# Altium project PCB_Project.PrjPcb (part 1 of 11)
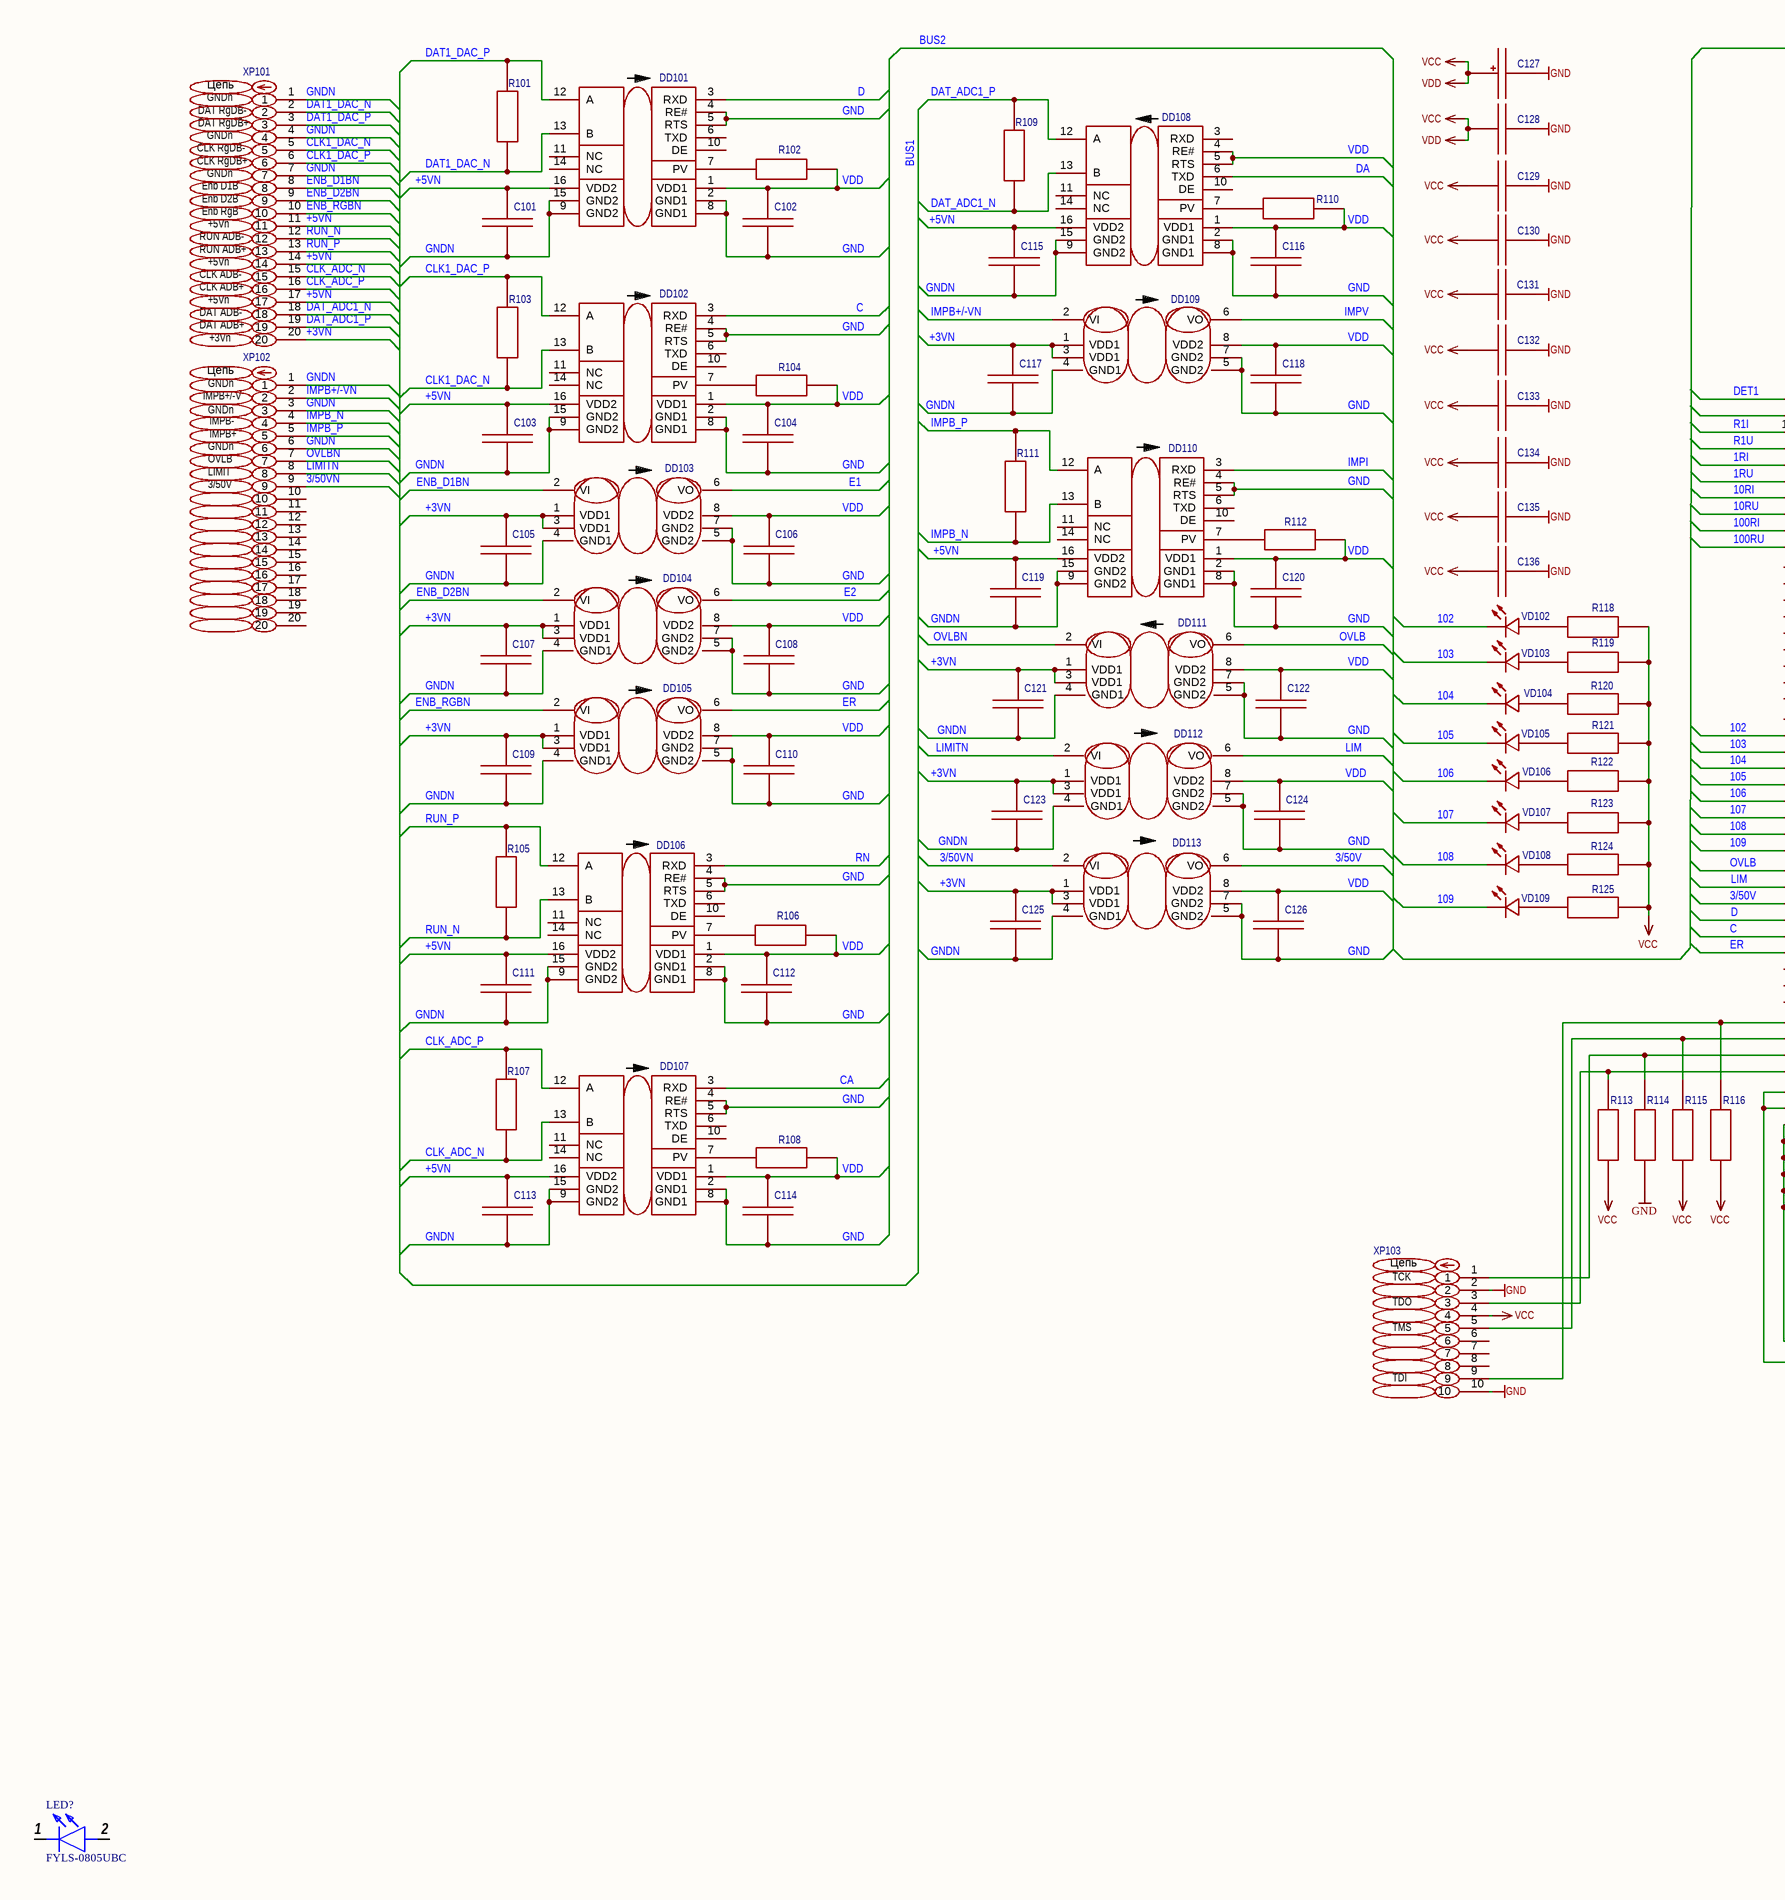
[diagram p0: УШЯИ.411618.029Э Э3 Лист 1.schdoc, left]
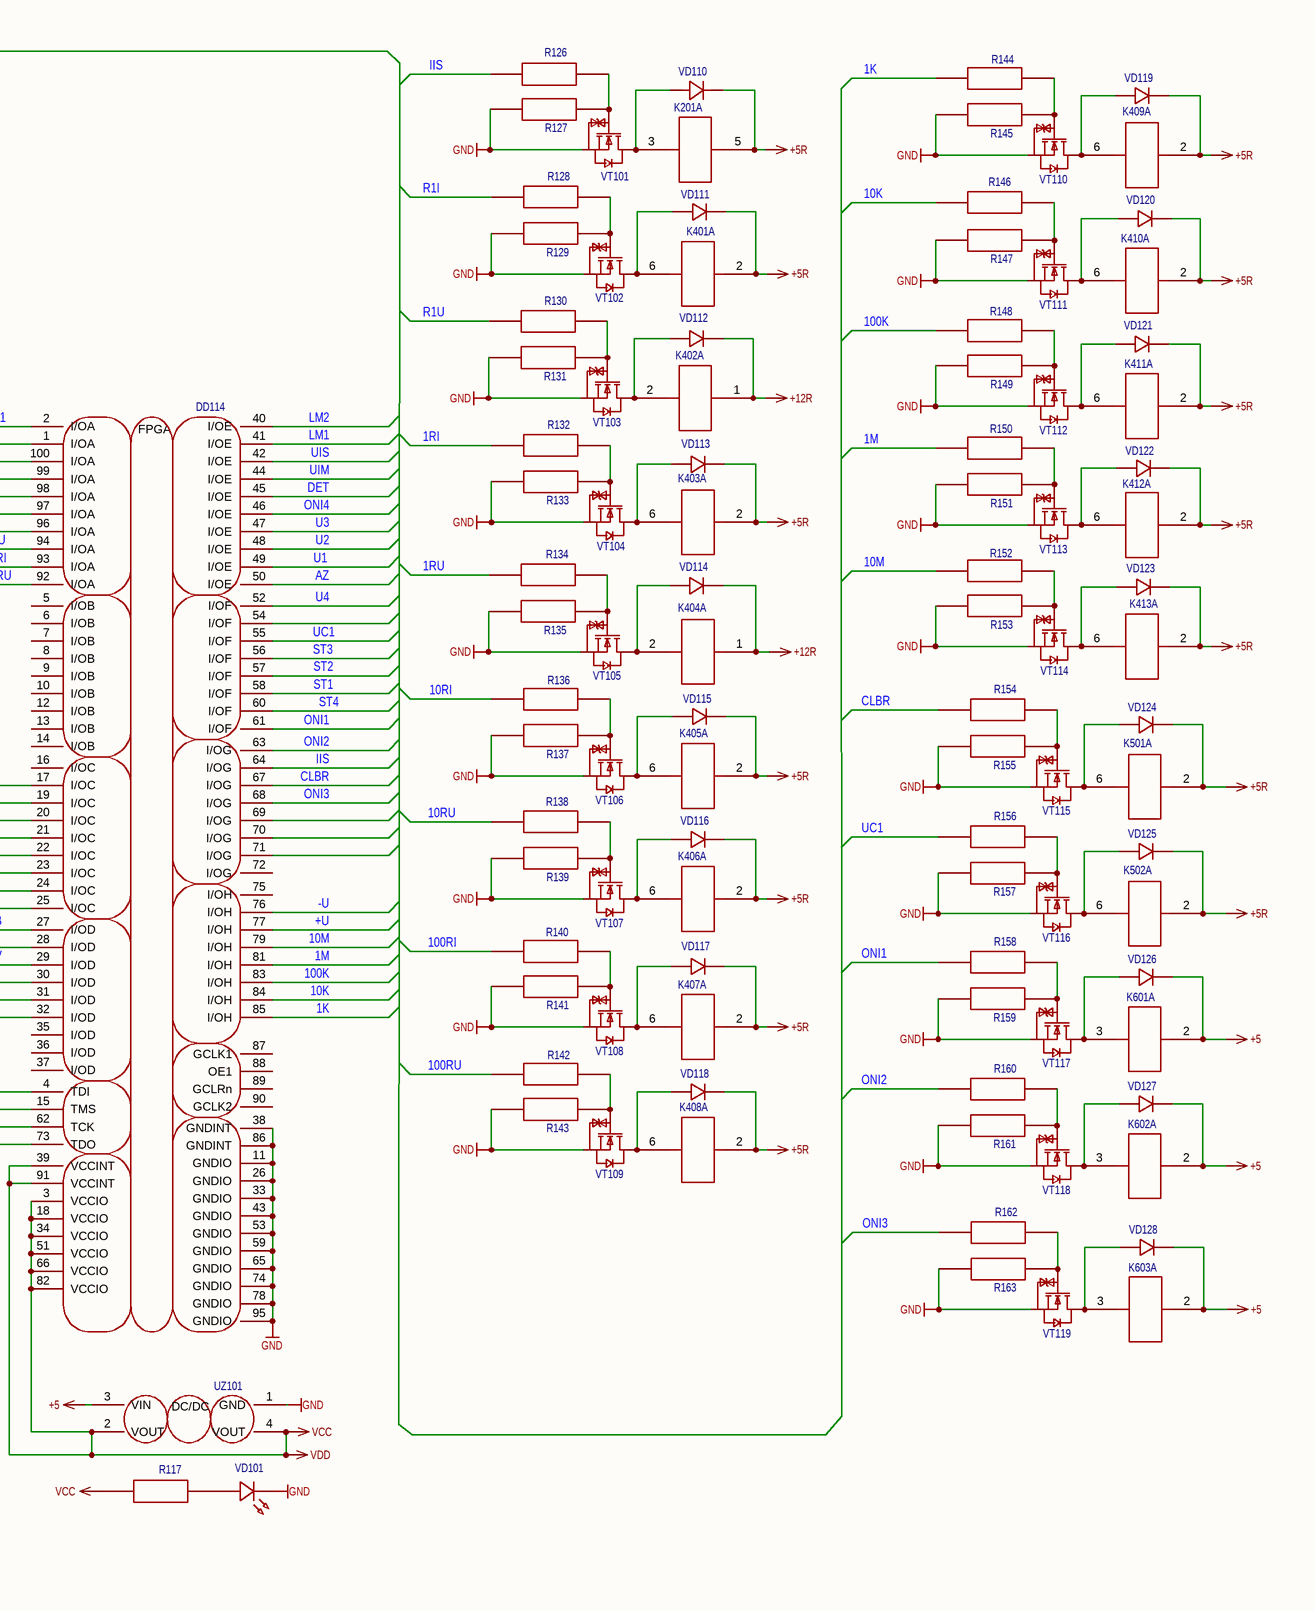
[diagram p1: УШЯИ.411618.029Э Э3 Лист 1.schdoc, right]
7 sheets, 636 parts. Net scope: global (net labels, ports and power ports of the same name join across sheets).
Board file: УШЯИ.411618.029Э.pcbdoc
Sheets:
  УШЯИ.411618.029Э Э3 Лист 1.schdoc
  УШЯИ.411618.029Э Э3 Лист 2.schdoc
  УШЯИ.411618.029Э Э3 Лист 3.schdoc
  УШЯИ.411618.029Э Э3 Лист 4.schdoc
  УШЯИ.411618.029Э Э3 Лист 5.schdoc
  УШЯИ.411618.029Э Э3 Лист 6.schdoc
  УШЯИ.411618.029Э Э3 Лист 7.schdoc

## Sheet УШЯИ.411618.029Э Э3 Лист 1.schdoc
size 594 x 420 mm; ApprovedBy: Володкевич; CheckedBy: Нестеров; Author: Ефименко; CompanyName: ОАО "МНИПИ"; DrawnBy: Ефименко; Engineer: Ефименко; Organization: ОАО "МНИПИ"; DocumentNumber: УШЯИ.411618.029Э; SheetNumber: 1; SheetTotal: 7

### Parts
(Parts that share a designator on the sheet are numbered #1, #2 ... from top to bottom, then left to right.)
C101  Конденсатор SMD 100нФ 100В X7R 10% [0805]  [C0805]  (value not drawn)
C102  Конденсатор SMD 100нФ 100В X7R 10% [0805]  [C0805]  (value not drawn)
C103  Конденсатор SMD 100нФ 100В X7R 10% [0805]  [C0805]  (value not drawn)
C104  Конденсатор SMD 100нФ 100В X7R 10% [0805]  [C0805]  (value not drawn)
C105  Конденсатор SMD 100нФ 100В X7R 10% [0805]  [C0805]  (value not drawn)
C106  Конденсатор SMD 100нФ 100В X7R 10% [0805]  [C0805]  (value not drawn)
C107  Конденсатор SMD 100нФ 100В X7R 10% [0805]  [C0805]  (value not drawn)
C108  Конденсатор SMD 100нФ 100В X7R 10% [0805]  [C0805]  (value not drawn)
C109  Конденсатор SMD 100нФ 100В X7R 10% [0805]  [C0805]  (value not drawn)
C110  Конденсатор SMD 100нФ 100В X7R 10% [0805]  [C0805]  (value not drawn)
C111  Конденсатор SMD 100нФ 100В X7R 10% [0805]  [C0805]  (value not drawn)
C112  Конденсатор SMD 100нФ 100В X7R 10% [0805]  [C0805]  (value not drawn)
C113  Конденсатор SMD 100нФ 100В X7R 10% [0805]  [C0805]  (value not drawn)
C114  Конденсатор SMD 100нФ 100В X7R 10% [0805]  [C0805]  (value not drawn)
C115  Конденсатор SMD 100нФ 100В X7R 10% [0805]  [C0805]  (value not drawn)
C116  Конденсатор SMD 100нФ 100В X7R 10% [0805]  [C0805]  (value not drawn)
C117  Конденсатор SMD 100нФ 100В X7R 10% [0805]  [C0805]  (value not drawn)
C118  Конденсатор SMD 100нФ 100В X7R 10% [0805]  [C0805]  (value not drawn)
C119  Конденсатор SMD 100нФ 100В X7R 10% [0805]  [C0805]  (value not drawn)
C120  Конденсатор SMD 100нФ 100В X7R 10% [0805]  [C0805]  (value not drawn)
C121  Конденсатор SMD 100нФ 100В X7R 10% [0805]  [C0805]  (value not drawn)
C122  Конденсатор SMD 100нФ 100В X7R 10% [0805]  [C0805]  (value not drawn)
C123  Конденсатор SMD 100нФ 100В X7R 10% [0805]  [C0805]  (value not drawn)
C124  Конденсатор SMD 100нФ 100В X7R 10% [0805]  [C0805]  (value not drawn)
C125  Конденсатор SMD 100нФ 100В X7R 10% [0805]  [C0805]  (value not drawn)
C126  Конденсатор SMD 100нФ 100В X7R 10% [0805]  [C0805]  (value not drawn)
C127  TECAP, 100мкФ, 10В, тип C  [CASE-C_6032]  (value not drawn)
C128  Конденсатор SMD 10мкФ 100В X7R 10% [0805]  [C0805]  (value not drawn)
C129  Конденсатор SMD 100нФ 100В X7R 10% [0805]  [C0805]  (value not drawn)
C130  Конденсатор SMD 100нФ 100В X7R 10% [0805]  [C0805]  (value not drawn)
C131  Конденсатор SMD 100нФ 100В X7R 10% [0805]  [C0805]  (value not drawn)
C132  Конденсатор SMD 100нФ 100В X7R 10% [0805]  [C0805]  (value not drawn)
C133  Конденсатор SMD 100нФ 100В X7R 10% [0805]  [C0805]  (value not drawn)
C134  Конденсатор SMD 100нФ 100В X7R 10% [0805]  [C0805]  (value not drawn)
C135  Конденсатор SMD 100нФ 100В X7R 10% [0805]  [C0805]  (value not drawn)
C136  Конденсатор SMD 100нФ 100В X7R 10% [0805]  [C0805]  (value not drawn)
DD101  Изолированный приемопередатчик ADM2486BRWZ-REEL [SOIC-16]  [SOIC-16_L10.3-W7.5-P1.27-LS10.3-BL]  (value not drawn)
DD102  Изолированный приемопередатчик ADM2486BRWZ-REEL [SOIC-16]  [SOIC-16_L10.3-W7.5-P1.27-LS10.3-BL]  (value not drawn)
DD103  Высокоскоростной цифровой изолятор ADUM1100BRZ-RL7 [SOIC-8]  [SOIC-8_L4.9-W3.9-P1.27-LS6.0-BL]  (value not drawn)
DD104  Высокоскоростной цифровой изолятор ADUM1100BRZ-RL7 [SOIC-8]  [SOIC-8_L4.9-W3.9-P1.27-LS6.0-BL]  (value not drawn)
DD105  Высокоскоростной цифровой изолятор ADUM1100BRZ-RL7 [SOIC-8]  [SOIC-8_L4.9-W3.9-P1.27-LS6.0-BL]  (value not drawn)
DD106  Изолированный приемопередатчик ADM2486BRWZ-REEL [SOIC-16]  [SOIC-16_L10.3-W7.5-P1.27-LS10.3-BL]  (value not drawn)
DD107  Изолированный приемопередатчик ADM2486BRWZ-REEL [SOIC-16]  [SOIC-16_L10.3-W7.5-P1.27-LS10.3-BL]  (value not drawn)
DD108  Изолированный приемопередатчик ADM2486BRWZ-REEL [SOIC-16]  [SOIC-16_L10.3-W7.5-P1.27-LS10.3-BL]  (value not drawn)
DD109  Высокоскоростной цифровой изолятор ADUM1100BRZ-RL7 [SOIC-8]  [SOIC-8_L4.9-W3.9-P1.27-LS6.0-BL]  (value not drawn)
DD110  Изолированный приемопередатчик ADM2486BRWZ-REEL [SOIC-16]  [SOIC-16_L10.3-W7.5-P1.27-LS10.3-BL]  (value not drawn)
DD111  Высокоскоростной цифровой изолятор ADUM1100BRZ-RL7 [SOIC-8]  [SOIC-8_L4.9-W3.9-P1.27-LS6.0-BL]  (value not drawn)
DD112  Высокоскоростной цифровой изолятор ADUM1100BRZ-RL7 [SOIC-8]  [SOIC-8_L4.9-W3.9-P1.27-LS6.0-BL]  (value not drawn)
DD113  Высокоскоростной цифровой изолятор ADUM1100BRZ-RL7 [SOIC-8]  [SOIC-8_L4.9-W3.9-P1.27-LS6.0-BL]  (value not drawn)
DD114  ПЛИС EPM3128ATC100-10N [TQFP-100]  [TQFP-100_L14.0-W14.0-P0.50-LS16.0-BL]  (value not drawn)
K201#1  Реле герконовое SIL05-1A72-71L [PCB]  [Реле герконовое DIP05-1C90-51L [PCB]]  (value not drawn)  (part A of 2)
K401  Реле герконовое DIP05-1A72-13L  [PCB]  [RELAY-TH_STANDEXMEDER_DIP05-1A72-13L]  (value not drawn)  (part A of 2)
K402  Реле герконовое УШЯИ.685442.092 (2 реле)  (value not drawn)  (part A of 2)
K403  Реле герконовое DIP05-1A72-13L  [PCB]  [RELAY-TH_STANDEXMEDER_DIP05-1A72-13L]  (value not drawn)  (part A of 2)
K404  Реле герконовое УШЯИ.685442.092 (1 реле)  (value not drawn)  (part A of 2)
K405  Реле герконовое DIP05-1A72-13L  [PCB]  [RELAY-TH_STANDEXMEDER_DIP05-1A72-13L]  (value not drawn)  (part A of 2)
K406  Реле герконовое DIP05-1A72-13L  [PCB]  [RELAY-TH_STANDEXMEDER_DIP05-1A72-13L]  (value not drawn)  (part A of 2)
K407  Реле герконовое DIP05-1A72-13L  [PCB]  [RELAY-TH_STANDEXMEDER_DIP05-1A72-13L]  (value not drawn)  (part A of 2)
K408  Реле герконовое DIP05-1A72-13L  [PCB]  [RELAY-TH_STANDEXMEDER_DIP05-1A72-13L]  (value not drawn)  (part A of 2)
K409  Реле герконовое DIP05-1A72-13L  [PCB]  [RELAY-TH_STANDEXMEDER_DIP05-1A72-13L]  (value not drawn)  (part A of 2)
K410  Реле герконовое DIP05-1A72-13L  [PCB]  [RELAY-TH_STANDEXMEDER_DIP05-1A72-13L]  (value not drawn)  (part A of 2)
K411  Реле герконовое DIP05-1A72-13L  [PCB]  [RELAY-TH_STANDEXMEDER_DIP05-1A72-13L]  (value not drawn)  (part A of 2)
K412  Реле герконовое DIP05-1A72-13L  [PCB]  [RELAY-TH_STANDEXMEDER_DIP05-1A72-13L]  (value not drawn)  (part A of 2)
K413  Реле герконовое DIP05-1A72-13L  [PCB]  [RELAY-TH_STANDEXMEDER_DIP05-1A72-13L]  (value not drawn)  (part A of 2)
K501  Реле герконовое DIP05-1A72-13L  [PCB]  [RELAY-TH_STANDEXMEDER_DIP05-1A72-13L]  (value not drawn)  (part A of 2)
K502  Реле герконовое DIP05-1A72-13L  [PCB]  [RELAY-TH_STANDEXMEDER_DIP05-1A72-13L]  (value not drawn)  (part A of 2)
K601#1  Реле герконовое DIP05-1C90-51L [PCB]  [Реле герконовое DIP05-1A72-13L  [PCB]]  (value not drawn)  (part A of 2)
K602#1  Реле герконовое DIP05-1C90-51L [PCB]  [Реле герконовое DIP05-1A72-13L  [PCB]]  (value not drawn)  (part A of 2)
K603  Реле герконовое DIP05-1C90-51L [PCB]  [Реле герконовое DIP05-1C90-51L [PCB]]  (value not drawn)  (part A of 2)
LED?  FYLS-0805UBC  [FYLS0805UBC]
R101  Резистор 100Ом 0,125Вт 1% [0805]  [R0805]  (value not drawn)
R102  Резистор 12кОм 0,125Вт 1% [0805]  [R0805]  (value not drawn)
R103  Резистор 100Ом 0,125Вт 1% [0805]  [R0805]  (value not drawn)
R104  Резистор 12кОм 0,125Вт 1% [0805]  [R0805]  (value not drawn)
R105  Резистор 100Ом 0,125Вт 1% [0805]  [R0805]  (value not drawn)
R106  Резистор 12кОм 0,125Вт 1% [0805]  [R0805]  (value not drawn)
R107  Резистор 100Ом 0,125Вт 1% [0805]  [R0805]  (value not drawn)
R108  Резистор 12кОм 0,125Вт 1% [0805]  [R0805]  (value not drawn)
R109  Резистор 100Ом 0,125Вт 1% [0805]  [R0805]  (value not drawn)
R110  Резистор 12кОм 0,125Вт 1% [0805]  [R0805]  (value not drawn)
R111  Резистор 100Ом 0,125Вт 1% [0805]  [R0805]  (value not drawn)
R112  Резистор 12кОм 0,125Вт 1% [0805]  [R0805]  (value not drawn)
R113  Резистор 1кОм 0,125Вт 1% [0805]  [R0805]  (value not drawn)
R114  Резистор 1кОм 0,125Вт 1% [0805]  [R0805]  (value not drawn)
R115  Резистор 1кОм 0,125Вт 1% [0805]  [R0805]  (value not drawn)
R116  Резистор 1кОм 0,125Вт 1% [0805]  [R0805]  (value not drawn)
R117  Резистор 100Ом 0,125Вт 1% [0805]  [R0805]  (value not drawn)
R118  Резистор 100Ом 0,125Вт 1% [0805]  [R0805]  (value not drawn)
R119  Резистор 100Ом 0,125Вт 1% [0805]  [R0805]  (value not drawn)
R120  Резистор 100Ом 0,125Вт 1% [0805]  [R0805]  (value not drawn)
R121  Резистор 100Ом 0,125Вт 1% [0805]  [R0805]  (value not drawn)
R122  Резистор 100Ом 0,125Вт 1% [0805]  [R0805]  (value not drawn)
R123  Резистор 100Ом 0,125Вт 1% [0805]  [R0805]  (value not drawn)
R124  Резистор 100Ом 0,125Вт 1% [0805]  [R0805]  (value not drawn)
R125  Резистор 100Ом 0,125Вт 1% [0805]  [R0805]  (value not drawn)
R126  Резистор 100Ом 0,125Вт 1% [0805]  [R0805]  (value not drawn)
R127  Резистор 100Ом 0,125Вт 1% [0805]  [R0805]  (value not drawn)
R128  Резистор 100Ом 0,125Вт 1% [0805]  [R0805]  (value not drawn)
R129  Резистор 100Ом 0,125Вт 1% [0805]  [R0805]  (value not drawn)
R130  Резистор 100Ом 0,125Вт 1% [0805]  [R0805]  (value not drawn)
R131  Резистор 100Ом 0,125Вт 1% [0805]  [R0805]  (value not drawn)
R132  Резистор 100Ом 0,125Вт 1% [0805]  [R0805]  (value not drawn)
R133  Резистор 100Ом 0,125Вт 1% [0805]  [R0805]  (value not drawn)
R134  Резистор 100Ом 0,125Вт 1% [0805]  [R0805]  (value not drawn)
R135  Резистор 100Ом 0,125Вт 1% [0805]  [R0805]  (value not drawn)
R136  Резистор 100Ом 0,125Вт 1% [0805]  [R0805]  (value not drawn)
R137  Резистор 100Ом 0,125Вт 1% [0805]  [R0805]  (value not drawn)
R138  Резистор 100Ом 0,125Вт 1% [0805]  [R0805]  (value not drawn)
R139  Резистор 100Ом 0,125Вт 1% [0805]  [R0805]  (value not drawn)
R140  Резистор 100Ом 0,125Вт 1% [0805]  [R0805]  (value not drawn)
R141  Резистор 100Ом 0,125Вт 1% [0805]  [R0805]  (value not drawn)
R142  Резистор 100Ом 0,125Вт 1% [0805]  [R0805]  (value not drawn)
R143  Резистор 100Ом 0,125Вт 1% [0805]  [R0805]  (value not drawn)
R144  Резистор 100Ом 0,125Вт 1% [0805]  [R0805]  (value not drawn)
R145  Резистор 100Ом 0,125Вт 1% [0805]  [R0805]  (value not drawn)
R146  Резистор 100Ом 0,125Вт 1% [0805]  [R0805]  (value not drawn)
R147  Резистор 100Ом 0,125Вт 1% [0805]  [R0805]  (value not drawn)
R148  Резистор 100Ом 0,125Вт 1% [0805]  [R0805]  (value not drawn)
R149  Резистор 100Ом 0,125Вт 1% [0805]  [R0805]  (value not drawn)
R150  Резистор 100Ом 0,125Вт 1% [0805]  [R0805]  (value not drawn)
R151  Резистор 100Ом 0,125Вт 1% [0805]  [R0805]  (value not drawn)
R152  Резистор 100Ом 0,125Вт 1% [0805]  [R0805]  (value not drawn)
R153  Резистор 100Ом 0,125Вт 1% [0805]  [R0805]  (value not drawn)
R154  Резистор 100Ом 0,125Вт 1% [0805]  [R0805]  (value not drawn)
R155  Резистор 100Ом 0,125Вт 1% [0805]  [R0805]  (value not drawn)
R156  Резистор 100Ом 0,125Вт 1% [0805]  [R0805]  (value not drawn)
R157  Резистор 100Ом 0,125Вт 1% [0805]  [R0805]  (value not drawn)
R158  Резистор 100Ом 0,125Вт 1% [0805]  [R0805]  (value not drawn)
R159  Резистор 100Ом 0,125Вт 1% [0805]  [R0805]  (value not drawn)
R160  Резистор 100Ом 0,125Вт 1% [0805]  [R0805]  (value not drawn)
R161  Резистор 100Ом 0,125Вт 1% [0805]  [R0805]  (value not drawn)
R162  Резистор 100Ом 0,125Вт 1% [0805]  [R0805]  (value not drawn)
R163  Резистор 100Ом 0,125Вт 1% [0805]  [R0805]  (value not drawn)
UZ101  Линейный регулятор напряжения LM1117GS-3.3 [SOT-223]  [SOT-223-3_L6.5-W3.4-P2.30-LS7.0-BR]  (value not drawn)
VD101  Светодиод YLED0805YG [0805]  [LED0805-R-RD]  (value not drawn)
VD102  Светодиод FYLS-0805GC [0805]  [FYLS-0805GC]  (value not drawn)
VD103  Светодиод FYLS-0805GC [0805]  [FYLS-0805GC]  (value not drawn)
VD104  Светодиод FYLS-0805GC [0805]  [FYLS-0805GC]  (value not drawn)
VD105  Светодиод FYLS-0805GC [0805]  [FYLS-0805GC]  (value not drawn)
VD106  Светодиод FYLS-0805GC [0805]  [FYLS-0805GC]  (value not drawn)
VD107  Светодиод FYLS-0805GC [0805]  [FYLS-0805GC]  (value not drawn)
VD108  Светодиод FYLS-0805GC [0805]  [FYLS-0805GC]  (value not drawn)
VD109  Светодиод FYLS-0805GC [0805]  [FYLS-0805GC]  (value not drawn)
VD110  Диод импульсный 1N4448 [SOD-123]  [SOD-123_L2.7-W1.6-LS3.7-RD-1]  (value not drawn)
VD111  Диод импульсный 1N4448 [DO-35]  [DO-35_BD2.0-L4.2-P8.20-D0.5-RD]  (value not drawn)
VD112  Диод импульсный 1N4448 [DO-35]  [DO-35_BD2.0-L4.2-P8.20-D0.5-RD]  (value not drawn)
VD113  Диод импульсный 1N4448 [DO-35]  [DO-35_BD2.0-L4.2-P8.20-D0.5-RD]  (value not drawn)
VD114  Диод импульсный 1N4448 [DO-35]  [DO-35_BD2.0-L4.2-P8.20-D0.5-RD]  (value not drawn)
VD115  Диод импульсный 1N4448 [DO-35]  [DO-35_BD2.0-L4.2-P8.20-D0.5-RD]  (value not drawn)
VD116  Диод импульсный 1N4448 [DO-35]  [DO-35_BD2.0-L4.2-P8.20-D0.5-RD]  (value not drawn)
VD117  Диод импульсный 1N4448 [DO-35]  [DO-35_BD2.0-L4.2-P8.20-D0.5-RD]  (value not drawn)
VD118  Диод импульсный 1N4448 [DO-35]  [DO-35_BD2.0-L4.2-P8.20-D0.5-RD]  (value not drawn)
VD119  Диод импульсный 1N4448 [DO-35]  [DO-35_BD2.0-L4.2-P8.20-D0.5-RD]  (value not drawn)
VD120  Диод импульсный 1N4448 [DO-35]  [DO-35_BD2.0-L4.2-P8.20-D0.5-RD]  (value not drawn)
VD121  Диод импульсный 1N4448 [DO-35]  [DO-35_BD2.0-L4.2-P8.20-D0.5-RD]  (value not drawn)
VD122  Диод импульсный 1N4448 [DO-35]  [DO-35_BD2.0-L4.2-P8.20-D0.5-RD]  (value not drawn)
VD123  Диод импульсный 1N4448 [DO-35]  [DO-35_BD2.0-L4.2-P8.20-D0.5-RD]  (value not drawn)
VD124  Диод импульсный 1N4448 [DO-35]  [DO-35_BD2.0-L4.2-P8.20-D0.5-RD]  (value not drawn)
VD125  Диод импульсный 1N4448 [DO-35]  [DO-35_BD2.0-L4.2-P8.20-D0.5-RD]  (value not drawn)
VD126  Диод импульсный 1N4448 [DO-35]  [DO-35_BD2.0-L4.2-P8.20-D0.5-RD]  (value not drawn)
VD127  Диод импульсный 1N4448 [DO-35]  [DO-35_BD2.0-L4.2-P8.20-D0.5-RD]  (value not drawn)
VD128  Диод импульсный 1N4448 [DO-35]  [DO-35_BD2.0-L4.2-P8.20-D0.5-RD]  (value not drawn)
VT101  Транзистор полевой MOSFET N-канальный BSS138BK [SOT-23-3]  [SOT-23-3_L2.9-W1.3-P1.90-LS2.4-BR]  (value not drawn)
VT102  Транзистор полевой MOSFET N-канальный BSS138BK [SOT-23-3]  [SOT-23-3_L2.9-W1.3-P1.90-LS2.4-BR]  (value not drawn)
VT103  Транзистор полевой MOSFET N-канальный BSS138BK [SOT-23-3]  [SOT-23-3_L2.9-W1.3-P1.90-LS2.4-BR]  (value not drawn)
VT104  Транзистор полевой MOSFET N-канальный BSS138BK [SOT-23-3]  [SOT-23-3_L2.9-W1.3-P1.90-LS2.4-BR]  (value not drawn)
VT105  Транзистор полевой MOSFET N-канальный BSS138BK [SOT-23-3]  [SOT-23-3_L2.9-W1.3-P1.90-LS2.4-BR]  (value not drawn)
VT106  Транзистор полевой MOSFET N-канальный BSS138BK [SOT-23-3]  [SOT-23-3_L2.9-W1.3-P1.90-LS2.4-BR]  (value not drawn)
VT107  Транзистор полевой MOSFET N-канальный BSS138BK [SOT-23-3]  [SOT-23-3_L2.9-W1.3-P1.90-LS2.4-BR]  (value not drawn)
VT108  Транзистор полевой MOSFET N-канальный BSS138BK [SOT-23-3]  [SOT-23-3_L2.9-W1.3-P1.90-LS2.4-BR]  (value not drawn)
VT109  Транзистор полевой MOSFET N-канальный BSS138BK [SOT-23-3]  [SOT-23-3_L2.9-W1.3-P1.90-LS2.4-BR]  (value not drawn)
VT110  Транзистор полевой MOSFET N-канальный BSS138BK [SOT-23-3]  [SOT-23-3_L2.9-W1.3-P1.90-LS2.4-BR]  (value not drawn)
VT111  Транзистор полевой MOSFET N-канальный BSS138BK [SOT-23-3]  [SOT-23-3_L2.9-W1.3-P1.90-LS2.4-BR]  (value not drawn)
VT112  Транзистор полевой MOSFET N-канальный BSS138BK [SOT-23-3]  [SOT-23-3_L2.9-W1.3-P1.90-LS2.4-BR]  (value not drawn)
VT113  Транзистор полевой MOSFET N-канальный BSS138BK [SOT-23-3]  [SOT-23-3_L2.9-W1.3-P1.90-LS2.4-BR]  (value not drawn)
VT114  Транзистор полевой MOSFET N-канальный BSS138BK [SOT-23-3]  [SOT-23-3_L2.9-W1.3-P1.90-LS2.4-BR]  (value not drawn)
VT115  Транзистор полевой MOSFET N-канальный BSS138BK [SOT-23-3]  [SOT-23-3_L2.9-W1.3-P1.90-LS2.4-BR]  (value not drawn)
VT116  Транзистор полевой MOSFET N-канальный BSS138BK [SOT-23-3]  [SOT-23-3_L2.9-W1.3-P1.90-LS2.4-BR]  (value not drawn)
VT117  Транзистор полевой MOSFET N-канальный BSS138BK [SOT-23-3]  [SOT-23-3_L2.9-W1.3-P1.90-LS2.4-BR]  (value not drawn)
VT118  Транзистор полевой MOSFET N-канальный BSS138BK [SOT-23-3]  [SOT-23-3_L2.9-W1.3-P1.90-LS2.4-BR]  (value not drawn)
VT119  Транзистор полевой MOSFET N-канальный BSS138BK [SOT-23-3]  [SOT-23-3_L2.9-W1.3-P1.90-LS2.4-BR]  (value not drawn)
XP101  Вилка на плату прямая BH2-20 (DS1014-20SF1B-B) 20pin шаг 2.00мм  [CONN-TH_20P-P2.00_DS1014-20SF1B]  (value not drawn)
XP102  Вилка на плату прямая BH2-20 (DS1014-20SF1B-B) 20pin шаг 2.00мм  [CONN-TH_20P-P2.00_DS1014-20SF1B]  (value not drawn)
XP103  Вилка на плату прямая BH-10 (DS1013-10S) 10pin шаг 2.54мм  [IDC-TH_10P-P2.54-V-R2-C5-S2.54]  (value not drawn)

### Nets
+5: K601#1.2 K602#1.2 K603.2 UZ101.3(VIN) VD126.1 VD127.1 VD128.1
+5R: K201#1.5 K401.2 K403.2 K405.2 K406.2 K407.2 K408.2 K409.2 K410.2 K411.2 K412.2 K413.2 K501.2 K502.2 VD110.1(C) VD111.1 VD113.1 VD115.1 VD116.1 VD117.1 VD118.1 VD119.1 VD120.1 VD121.1 VD122.1 VD123.1 VD124.1 VD125.1
+12R: K402.1 K404.1 VD112.1 VD114.1
GND: C102.1 C104.1 C106.1 C108.1 C110.1 C112.1 C114.1 C116.1 C118.1 C120.1 C122.1 C124.1 C126.1 C127.2 C128.1 C129.2 C130.2 C131.2 C132.2 C133.2 C134.2 C135.2 C136.2 DD101.2(GND1) DD101.4(RE#) DD101.5(RTS) DD101.8(GND1) DD102.2(GND1) DD102.4(RE#) DD102.5(RTS) DD102.8(GND1) DD103.5(GND2) DD103.7(GND2) DD104.5(GND2) DD104.7(GND2) DD105.5(GND2) DD105.7(GND2) DD106.2(GND1) DD106.4(RE#) DD106.5(RTS) DD106.8(GND1) DD107.2(GND1) DD107.4(RE#) DD107.5(RTS) DD107.8(GND1) DD108.2(GND1) DD108.8(GND1) DD109.5(GND2) DD109.7(GND2) DD110.2(GND1) DD110.4(RE#) DD110.5(RTS) DD110.8(GND1) DD111.5(GND2) DD111.7(GND2) DD112.5(GND2) DD112.7(GND2) DD113.5(GND2) DD113.7(GND2) DD114.11(GNDIO) DD114.26(GNDIO) DD114.33(GNDIO) DD114.38(GNDINT) DD114.43(GNDIO) DD114.53(GNDIO) DD114.59(GNDIO) DD114.65(GNDIO) DD114.74(GNDIO) DD114.78(GNDIO) DD114.86(GNDINT) DD114.95(GNDIO) R114.1 R127.1 R129.1 R131.1 R133.1 R135.1 R137.1 R139.1 R141.1 R143.1 R145.1 R147.1 R149.1 R151.1 R153.1 R155.1 R157.1 R159.1 R161.1 R163.1 UZ101.1(GND) VD101.2 VT101.2(S) VT102.2(S) VT103.2(S) VT104.2(S) VT105.2(S) VT106.2(S) VT107.2(S) VT108.2(S) VT109.2(S) VT110.2(S) VT111.2(S) VT112.2(S) VT113.2(S) VT114.2(S) VT115.2(S) VT116.2(S) VT117.2(S) VT118.2(S) VT119.2(S) XP103.2 XP103.10
VDD: C102.2 C104.2 C106.2 C108.2 C110.2 C112.2 C114.2 C116.2 C118.2 C120.2 C122.2 C124.2 C126.2 C127.1 C128.2 C129.1 C130.1 C131.1 C132.1 C133.1 C134.1 C135.1 C136.1 DD101.1(VDD1) DD102.1(VDD1) DD103.8(VDD2) DD104.8(VDD2) DD105.8(VDD2) DD106.1(VDD1) DD107.1(VDD1) DD108.1(VDD1) DD108.4(RE#) DD108.5(RTS) DD109.8(VDD2) DD110.1(VDD1) DD111.8(VDD2) DD112.8(VDD2) DD113.8(VDD2) DD114.3(VCCIO) DD114.18(VCCIO) DD114.34(VCCIO) DD114.39(VCCINT) DD114.51(VCCIO) DD114.66(VCCIO) DD114.82(VCCIO) DD114.91(VCCINT) R102.1 R104.1 R106.1 R108.1 R110.1 R112.1 R113.1 R115.1 R116.1 R117.1 R118.1 R119.1 R120.1 R121.1 R122.1 R123.1 R124.1 R125.1 UZ101.2(VOUT) UZ101.4(VOUT) XP103.4  [also labelled VCC]
1K: DD114.85(I/OH) R144.1
1M: DD114.81(I/OH) R150.1
1RI: DD114.98(I/OA) R132.1
1RU: DD114.97(I/OA) R134.1
3/50V: DD113.6(VO) DD114.29(I/OD)
3/50VN: DD113.2(VI) XP102.9
10K: DD114.84(I/OH) R146.1
10M: DD114.79(I/OH) R152.1
10RI: DD114.96(I/OA) R136.1
10RU: DD114.94(I/OA) R138.1
100K: DD114.83(I/OH) R148.1
100RI: DD114.93(I/OA) R140.1
100RU: DD114.92(I/OA) R142.1
102: DD114.17(I/OC) VD102.1(K)
103: DD114.19(I/OC) VD103.1(K)
104: DD114.20(I/OC) VD104.1(K)
105: DD114.21(I/OC) VD105.1(K)
106: DD114.22(I/OC) VD106.1(K)
107: DD114.23(I/OC) VD107.1(K)
108: DD114.24(I/OC) VD108.1(K)
109: DD114.25(I/OC) VD109.1(K)
+3VN: C105.2 C107.2 C109.2 C117.2 C121.2 C123.2 C125.2 DD103.1(VDD1) DD103.3(VDD1) DD104.1(VDD1) DD104.3(VDD1) DD105.1(VDD1) DD105.3(VDD1) DD109.1(VDD1) DD109.3(VDD1) DD111.1(VDD1) DD111.3(VDD1) DD112.1(VDD1) DD112.3(VDD1) DD113.1(VDD1) DD113.3(VDD1) XP101.20
+5VN: C101.2 C103.2 C111.2 C113.2 C115.2 C119.2 DD101.16(VDD2) DD102.16(VDD2) DD106.16(VDD2) DD107.16(VDD2) DD108.16(VDD2) DD110.16(VDD2) XP101.11 XP101.14 XP101.17
+U: DD114.77(I/OH)
-U: DD114.76(I/OH)
AZ: DD114.50(I/OE)
C: DD102.3(RXD) DD114.31(I/OD)
CA: DD107.3(RXD)
CLBR: DD114.67(I/OG) R154.1
CLK1_DAC_N: DD102.13(B) R103.2 XP101.5
CLK1_DAC_P: DD102.12(A) R103.1 XP101.6
CLK_ADC_N: DD107.13(B) R107.2 XP101.15
CLK_ADC_P: DD107.12(A) R107.1 XP101.16
D: DD101.3(RXD) DD114.30(I/OD)
DA: DD108.6(TXD)
DAT1_DAC_N: DD101.13(B) R101.2 XP101.2
DAT1_DAC_P: DD101.12(A) R101.1 XP101.3
DAT_ADC1_N: DD108.13(B) R109.2 XP101.18
DAT_ADC1_P: DD108.12(A) R109.1 XP101.19
DET: DD114.45(I/OE)
DET1: DD114.2(I/OA)
E1: DD103.6(VO)
E2: DD104.6(VO)
ENB_D1BN: DD103.2(VI) XP101.8
ENB_D2BN: DD104.2(VI) XP101.9
ENB_RGBN: DD105.2(VI) XP101.10
ER: DD105.6(VO) DD114.32(I/OD)
GNDN: C101.1 C103.1 C105.1 C107.1 C109.1 C111.1 C113.1 C115.1 C117.1 C119.1 C121.1 C123.1 C125.1 DD101.9(GND2) DD101.15(GND2) DD102.9(GND2) DD102.15(GND2) DD103.4(GND1) DD104.4(GND1) DD105.4(GND1) DD106.9(GND2) DD106.15(GND2) DD107.9(GND2) DD107.15(GND2) DD108.9(GND2) DD108.15(GND2) DD109.4(GND1) DD110.9(GND2) DD110.15(GND2) DD111.4(GND1) DD112.4(GND1) DD113.4(GND1) XP101.1 XP101.4 XP101.7 XP102.1 XP102.3 XP102.6
IIS: DD114.64(I/OG) R126.1
IMPB+/-VN: DD109.2(VI) XP102.2
IMPB_N: DD110.13(B) R111.2 XP102.4
IMPB_P: DD110.12(A) R111.1 XP102.5
IMPI: DD110.3(RXD)
IMPV: DD109.6(VO)
LIM: DD112.6(VO) DD114.28(I/OD)
LIMITN: DD112.2(VI) XP102.8
LM1: DD114.41(I/OE)
LM2: DD114.40(I/OE)
ONI1: DD114.61(I/OF) R158.1
ONI2: DD114.63(I/OG) R160.1
ONI3: DD114.68(I/OG) R162.1
ONI4: DD114.46(I/OE)
OVLB: DD111.6(VO) DD114.27(I/OD)
OVLBN: DD111.2(VI) XP102.7
R1I: DD114.100(I/OA) R128.1
R1U: DD114.99(I/OA) R130.1
RN: DD106.3(RXD)
RUN_N: DD106.13(B) R105.2 XP101.12
RUN_P: DD106.12(A) R105.1 XP101.13
ST1: DD114.58(I/OF)
ST2: DD114.57(I/OF)
ST3: DD114.56(I/OF)
ST4: DD114.60(I/OF)
U1: DD114.49(I/OE)
U2: DD114.48(I/OE)
U3: DD114.47(I/OE)
U4: DD114.52(I/OF)
UC1: DD114.55(I/OF) R156.1
UIM: DD114.44(I/OE)
UIS: DD114.42(I/OE)
NetDD101_7: DD101.7(PV) R102.2
NetDD102_7: DD102.7(PV) R104.2
NetDD106_7: DD106.7(PV) R106.2
NetDD107_7: DD107.7(PV) R108.2
NetDD108_7: DD108.7(PV) R110.2
NetDD110_7: DD110.7(PV) R112.2
NetDD114_4: DD114.4(TDI) R116.2 XP103.9
NetDD114_15: DD114.15(TMS) R115.2 XP103.5
NetDD114_62: DD114.62(TCK) R114.2 XP103.1
NetDD114_73: DD114.73(TDO) R113.2 XP103.3
NetK201#1_3: K201#1.3 VD110.2(A) VT101.3(D)
NetK401_6: K401.6 VD111.2 VT102.3(D)
NetK402_2: K402.2 VD112.2 VT103.3(D)
NetK403_6: K403.6 VD113.2 VT104.3(D)
NetK404_2: K404.2 VD114.2 VT105.3(D)
NetK405_6: K405.6 VD115.2 VT106.3(D)
NetK406_6: K406.6 VD116.2 VT107.3(D)
NetK407_6: K407.6 VD117.2 VT108.3(D)
NetK408_6: K408.6 VD118.2 VT109.3(D)
NetK409_6: K409.6 VD119.2 VT110.3(D)
NetK410_6: K410.6 VD120.2 VT111.3(D)
NetK411_6: K411.6 VD121.2 VT112.3(D)
NetK412_6: K412.6 VD122.2 VT113.3(D)
NetK413_6: K413.6 VD123.2 VT114.3(D)
NetK501_6: K501.6 VD124.2 VT115.3(D)
NetK502_6: K502.6 VD125.2 VT116.3(D)
NetK601#1_3: K601#1.3 VD126.2 VT117.3(D)
NetK602#1_3: K602#1.3 VD127.2 VT118.3(D)
NetK603_3: K603.3 VD128.2 VT119.3(D)
NetR117_2: R117.2 VD101.1
NetR118_2: R118.2 VD102.2(A)
NetR119_2: R119.2 VD103.2(A)
NetR120_2: R120.2 VD104.2(A)
NetR121_2: R121.2 VD105.2(A)
NetR122_2: R122.2 VD106.2(A)
NetR123_2: R123.2 VD107.2(A)
NetR124_2: R124.2 VD108.2(A)
NetR125_2: R125.2 VD109.2(A)
NetR126_2: R126.2 R127.2 VT101.1(G)
NetR128_2: R128.2 R129.2 VT102.1(G)
NetR130_2: R130.2 R131.2 VT103.1(G)
NetR132_2: R132.2 R133.2 VT104.1(G)
NetR134_2: R134.2 R135.2 VT105.1(G)
NetR136_2: R136.2 R137.2 VT106.1(G)
NetR138_2: R138.2 R139.2 VT107.1(G)
NetR140_2: R140.2 R141.2 VT108.1(G)
NetR142_2: R142.2 R143.2 VT109.1(G)
NetR144_2: R144.2 R145.2 VT110.1(G)
NetR146_2: R146.2 R147.2 VT111.1(G)
NetR148_2: R148.2 R149.2 VT112.1(G)
NetR150_2: R150.2 R151.2 VT113.1(G)
NetR152_2: R152.2 R153.2 VT114.1(G)
NetR154_2: R154.2 R155.2 VT115.1(G)
NetR156_2: R156.2 R157.2 VT116.1(G)
NetR158_2: R158.2 R159.2 VT117.1(G)
NetR160_2: R160.2 R161.2 VT118.1(G)
NetR162_2: R162.2 R163.2 VT119.1(G)

Not connected (* = marked no-connect by the designer): DD101 6(TXD) 10(DE) 11(NC) 14(NC); DD102 6(TXD) 10(DE) 11(NC) 14(NC); DD106 6(TXD) 10(DE) 11(NC) 14(NC); DD107 6(TXD) 10(DE) 11(NC) 14(NC); DD108 3(RXD) 10(DE) 11(NC) 14(NC); DD110 6(TXD) 10(DE) 11(NC) 14(NC); DD114 1(I/OA) 5(I/OB) 6(I/OB) 7(I/OB) 8(I/OB) 9(I/OB) 10(I/OB) 12(I/OB) 13(I/OB) 14(I/OB) 16(I/OC) 35(I/OD) 36(I/OD) 37(I/OD) 54(I/OF) 69(I/OG) 70(I/OG) 71(I/OG) 72(I/OG) 75(I/OH) 87(GCLK1) 88(OE1) 89(GCLRn) 90(GCLK2); LED? 1(K) 2(A); XP102 10 11 12 13 14 15 16 17 18 19 20; XP103 6 7 8

### Buses and harness runs
bus BUS1
bus BUS2

### Notes on the sheet
- (near XP101) CLK RgDB-
- (near XP101) DAT RgDB-
- (near XP101) DAT RgDB+
- (near XP101) GNDn
- (near XP101) CLK RgDB+
- (near XP101) Enb D1B
- (near XP101) Enb D2B
- (near XP101) Enb RgB
- (near XP101) RUN ADB-
- (near XP101) RUN ADB+
- (near XP101) CLK ADB-
- (near XP101) +5Vn
- (near XP101) CLK ADB+
- (near XP101) DAT ADB-
- (near XP101) DAT ADB+
- +3Vn
- (near XP102) IMPB+/-V
- GNDn
- (near XP102) GNDn
- (near XP102) OVLB
- (near XP102) LIMIT
- (near XP102) IMPB-
- (near XP102) IMPB+
- (near XP102) 3/50V
- (near XP103) TCK
- (near XP103) TMS
- (near XP103) TDO
- (near XP103) TDI
- Перв.примен.
- Справ.№
- Подп. и дата
- Инв.№ дубл.
- Взам.инв.№
- Подп.и дата
- Разраб.
- Изм.
- Лист
- Ефименко
- № докум.
- Подп.
- Дата
- Лит.
- Масштаб
- Масса
- Т.контр.
- Пров.
- СХЕМА   ЭЛЕКТРИЧЕСКАЯ
- ПРИНЦИПИАЛЬНАЯ
- Листов
- Инв.№ подл.
- Утв.
- Н.контр.
- Нач.сект.
- ОАО "МНИПИ"
- Формат  A2
- (in symbol Вилка на плату прямая BH2-20 (DS1014-20SF1B-B) 20pin шаг 2.00мм) Цепь
- (in symbol Вилка на плату прямая BH-10 (DS1013-10S) 10pin шаг 2.54мм) Цепь
- (in symbol Линейный регулятор напряжения LM1117GS-3.3 [SOT-223]) DC/DC
- (in symbol ПЛИС EPM3128ATC100-10N [TQFP-100]) FPGA